# Altium project AMEv3.PrjPCB
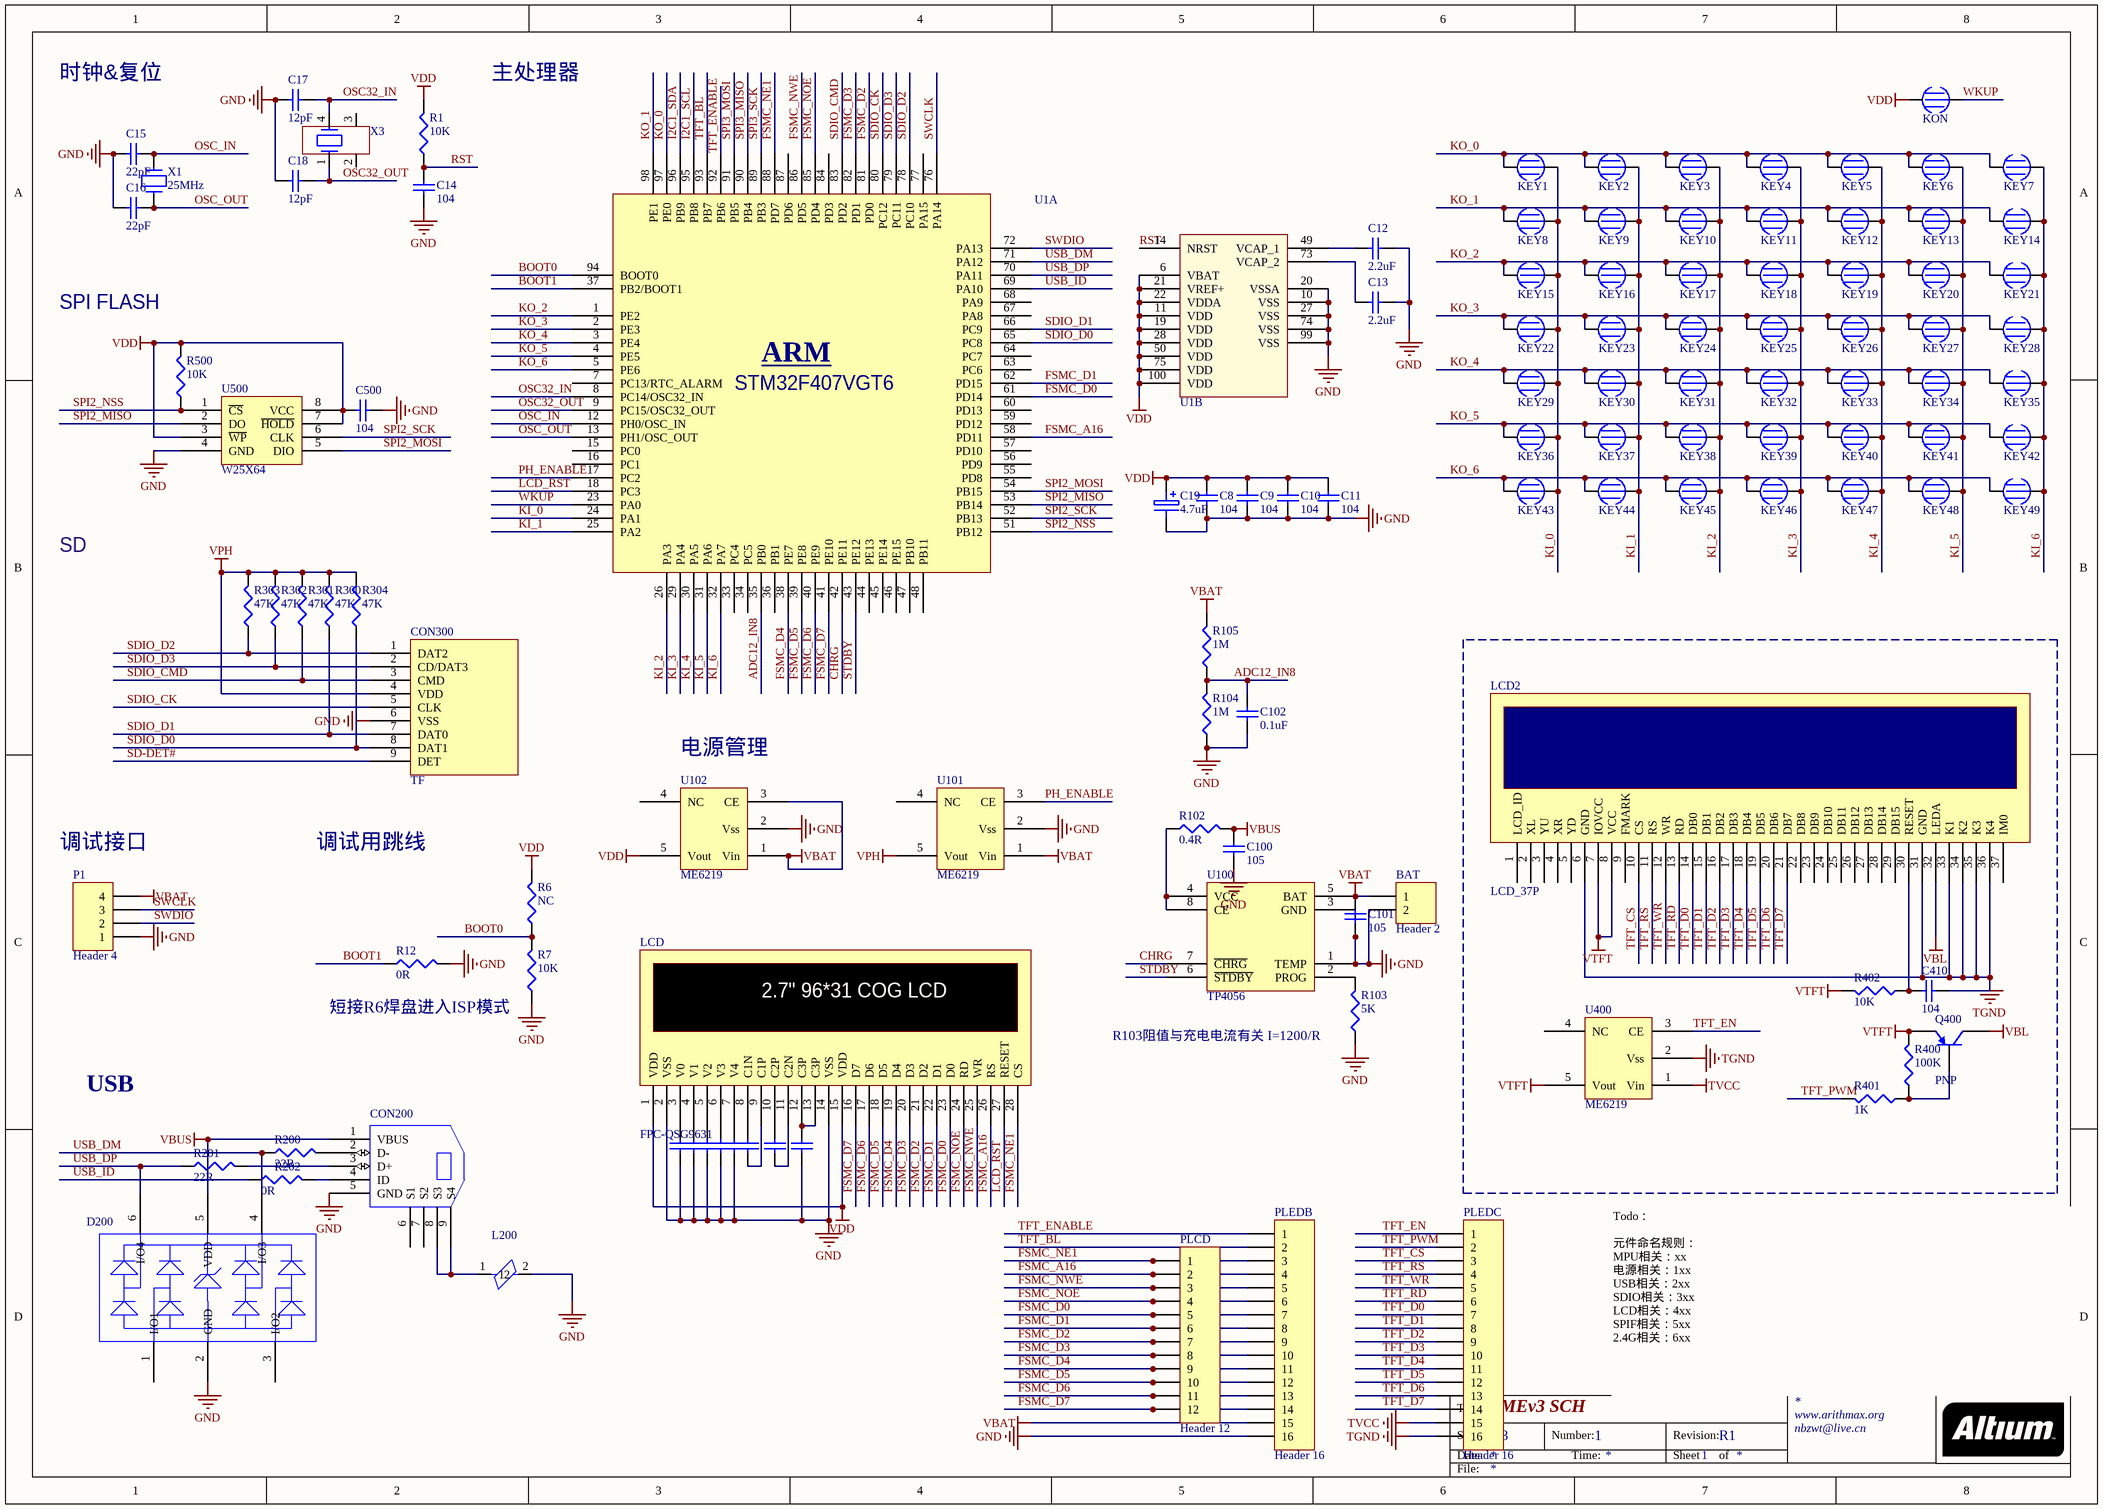
[diagram p0: SheetMain.SchDoc]
1 sheet, 115 parts. Net scope: global (net labels, ports and power ports of the same name join across sheets).
Board file: PCB1-B.PcbDoc

## Sheet SheetMain.SchDoc: AMEv3 SCH
size A3; ApprovedBy: Zweb; CheckedBy: Zweb; Author: Zweb; CompanyName: AMTech; DrawnBy: Zweb; Engineer: Zweb; Address1: www.arithmax.org; Address2: nbzwt@live.cn; DocumentNumber: 1; Revision: R1; SheetNumber: 1; DocumentName: AMEv3 Sch; ProjectName: ArithMax Entry

### Parts
BAT  Header 2  [HDR1X2]
C8  104  [1608[0603]]
C9  104  [1608[0603]]
C10  104  [1608[0603]]
C11  104  [1608[0603]]
C12  2.2uF  [1608[0603]]
C13  2.2uF  [1608[0603]]
C14  104  [1608[0603]]
C15  22pF  [1608[0603]]
C16  22pF  [1608[0603]]
C17  12pF  [1608[0603]]
C18  12pF  [1608[0603]]
C19  4.7uF  [1608[0603]]
C100  105  [1608[0603]]
C101  105  [1608[0603]]
C102  0.1uF  [1608[0603]]
C400  2.2uF  [1608[0603]]  (value not drawn)
C401  2.2uF  [1608[0603]]  (value not drawn)
C402  2.2uF  [1608[0603]]  (value not drawn)
C403  2.2uF  [1608[0603]]  (value not drawn)
C404  2.2uF  [1608[0603]]  (value not drawn)
C405  2.2uF  [1608[0603]]  (value not drawn)
C406  0.1uF  [1608[0603]]  (value not drawn)
C407  0.1uF  [1608[0603]]  (value not drawn)
C410  104  [1608[0603]]
C500  104  [1608[0603]]
CON200  USB-MINIAB  [USB-MICRO]  (value not drawn)
CON300  TF  [TF-2]
D200  AZC099-04S  [SOT-23-6]  (value not drawn)
KEY1  Button  [Button]  (value not drawn)
KEY2  Button  [Button]  (value not drawn)
KEY3  Button  [Button]  (value not drawn)
KEY4  Button  [Button]  (value not drawn)
KEY5  Button  [Button]  (value not drawn)
KEY6  Button  [Button]  (value not drawn)
KEY7  Button  [Button]  (value not drawn)
KEY8  Button  [Button]  (value not drawn)
KEY9  Button  [Button]  (value not drawn)
KEY10  Button  [Button]  (value not drawn)
KEY11  Button  [Button]  (value not drawn)
KEY12  Button  [Button]  (value not drawn)
KEY13  Button  [Button]  (value not drawn)
KEY14  Button  [Button]  (value not drawn)
KEY15  Button  [Button]  (value not drawn)
KEY16  Button  [Button]  (value not drawn)
KEY17  Button  [Button]  (value not drawn)
KEY18  Button  [Button]  (value not drawn)
KEY19  Button  [Button]  (value not drawn)
KEY20  Button  [Button]  (value not drawn)
KEY21  Button  [Button]  (value not drawn)
KEY22  Button  [Button]  (value not drawn)
KEY23  Button  [Button]  (value not drawn)
KEY24  Button  [Button]  (value not drawn)
KEY25  Button  [Button]  (value not drawn)
KEY26  Button  [Button]  (value not drawn)
KEY27  Button  [Button]  (value not drawn)
KEY28  Button  [Button]  (value not drawn)
KEY29  Button  [Button]  (value not drawn)
KEY30  Button  [Button]  (value not drawn)
KEY31  Button  [Button]  (value not drawn)
KEY32  Button  [Button]  (value not drawn)
KEY33  Button  [Button]  (value not drawn)
KEY34  Button  [Button]  (value not drawn)
KEY35  Button  [Button]  (value not drawn)
KEY36  Button  [Button]  (value not drawn)
KEY37  Button  [Button]  (value not drawn)
KEY38  Button  [Button]  (value not drawn)
KEY39  Button  [Button]  (value not drawn)
KEY40  Button  [Button]  (value not drawn)
KEY41  Button  [Button]  (value not drawn)
KEY42  Button  [Button]  (value not drawn)
KEY43  Button  [Button]  (value not drawn)
KEY44  Button  [Button]  (value not drawn)
KEY45  Button  [Button]  (value not drawn)
KEY46  Button  [Button]  (value not drawn)
KEY47  Button  [Button]  (value not drawn)
KEY48  Button  [Button]  (value not drawn)
KEY49  Button  [Button]  (value not drawn)
KON  Button  [Button]  (value not drawn)
L200  BLM21PG221SN1  [0805]  (value not drawn)
LCD  FPC-QSG9631  [LCD_28P]
LCD2  LCD_37P  [LCD_37P]
P1  Header 4  [HDR1X4]
PLCD  Header 12  [HDR1X12]
PLEDB  Header 16  [CON_16P_1.0MM]
PLEDC  Header 16  [CON_16P_1.0MM]
Q400  PNP  [SOT-23B_N]
R1  10K  [J1-0603]
R6  NC  [J1-0603]
R7  10K  [J1-0603]
R12  0R  [J1-0603]
R102  0.4R  [J1-0603]
R103  5K  [J1-0603]
R104  1M  [J1-0603]
R105  1M  [J1-0603]
R200  22R  [J1-0603]
R201  22R  [J1-0603]
R202  0R  [J1-0603]
R300  47K  [J1-0603]
R301  47K  [J1-0603]
R302  47K  [J1-0603]
R303  47K  [J1-0603]
R304  47K  [J1-0603]
R400  100K  [J1-0603]
R401  1K  [J1-0603]
R402  10K  [J1-0603]
R500  10K  [J1-0603]
U1  STM32F407VG  [100T1_L]  (value not drawn)  (parts A,B of 2)
U100  TP4056  [SO-8]
U101  ME6219  [SOT-23-5]
U102  ME6219  [SOT-23-5]
U400  ME6219  [SOT-23-5]
U500  W25X64  [SOIC8]
X1  25MHz  [5032]
X3  MC306-G-06Q-32.768 (manufacturer JFVNY)  [SM8]  (value not drawn)

### Nets
GND: BAT.2 C8.2 C9.2 C10.2 C11.2 C12.2 C13.2 C14.1 C15.2 C16.2 C17.2 C18.2 C19.2(E) C100.1 C101.1 C102.1 C400.1 C401.1 C402.1 C403.1 C404.1 C407.1 C500.2 CON200.5(GND) CON300.6(VSS) D200.2(GND) L200.2 LCD.2(VSS) LCD.14(VSS) P1.1 PLEDB.16 R7.1 R12.2 R103.1 R104.1 U1.10(VSS) U1.20(VSSA) U1.27(VSS) U1.74(VSS) U1.99(VSS) U100.1(TEMP) U100.3(GND) U101.2(Vss) U102.2(Vss) U500.4(GND)
TGND: C410.1 LCD2.6(GND) LCD2.31(GND) LCD2.33(K1) LCD2.34(K2) LCD2.35(K3) LCD2.36(K4) PLEDC.16 U400.2(Vss)
TVCC: PLEDC.15 U400.1(Vin)
VBAT: BAT.1 C101.2 P1.4 PLEDB.15 R105.2 U100.5(BAT) U101.1(Vin) U102.1(Vin) U102.3(CE)
VBL: LCD2.32(LEDA) Q400.1(C)
VBUS: C100.2 CON200.1(VBUS) D200.5(VDD) R102.2
VDD: C8.1 C9.1 C10.1 C11.1 C19.1 C500.1 KON.1 LCD.1(VDD) LCD.15(VDD) R1.2 R6.2 R500.2 U1.6(VBAT) U1.11(VDD) U1.19(VDD) U1.21(VREF+) U1.22(VDDA) U1.28(VDD) U1.50(VDD) U1.75(VDD) U1.100(VDD) U102.5(Vout) U500.3(~{WP}) U500.7(~{HOLD}) U500.8(VCC)
VPH: CON300.4(VDD) R300.2 R301.2 R302.2 R303.2 R304.2 U101.5(Vout)
VTFT: LCD2.7(IOVCC) LCD2.8(VCC) Q400.3(E) R400.2 R402.2 U400.5(Vout)
ADC12_IN8: C102.2 R104.2 R105.1 U1.35(PB0)
BOOT0: R6.1 R7.2 U1.94(BOOT0)
BOOT1: R12.1 U1.37(PB2/BOOT1)
CHRG: U1.42(PE11) U100.7(~{CHRG})
FSMC_A16: LCD.26(RS) PLCD.2 PLEDB.4 U1.58(PD11)
FSMC_D0: LCD.23(D0) PLCD.5 PLEDB.7 U1.61(PD14)
FSMC_D1: LCD.22(D1) PLCD.6 PLEDB.8 U1.62(PD15)
FSMC_D2: LCD.21(D2) PLCD.7 PLEDB.9 U1.81(PD0)
FSMC_D3: LCD.20(D3) PLCD.8 PLEDB.10 U1.82(PD1)
FSMC_D4: LCD.19(D4) PLCD.9 PLEDB.11 U1.38(PE7)
FSMC_D5: LCD.18(D5) PLCD.10 PLEDB.12 U1.39(PE8)
FSMC_D6: LCD.17(D6) PLCD.11 PLEDB.13 U1.40(PE9)
FSMC_D7: LCD.16(D7) PLCD.12 PLEDB.14 U1.41(PE10)
FSMC_NE1: LCD.28(CS) PLCD.1 PLEDB.3 U1.88(PD7)
FSMC_NOE: LCD.24(RD) PLCD.4 PLEDB.6 U1.85(PD4)
FSMC_NWE: LCD.25(WR) PLCD.3 PLEDB.5 U1.86(PD5)
I2C1_SCL: U1.95(PB8)
I2C1_SDA: U1.96(PB9)
KI_0: KEY1.2 KEY8.2 KEY15.2 KEY22.2 KEY29.2 KEY36.2 KEY43.2 U1.24(PA1)
KI_1: KEY2.2 KEY9.2 KEY16.2 KEY23.2 KEY30.2 KEY37.2 KEY44.2 U1.25(PA2)
KI_2: KEY3.2 KEY10.2 KEY17.2 KEY24.2 KEY31.2 KEY38.2 KEY45.2 U1.26(PA3)
KI_3: KEY4.2 KEY11.2 KEY18.2 KEY25.2 KEY32.2 KEY39.2 KEY46.2 U1.29(PA4)
KI_4: KEY5.2 KEY12.2 KEY19.2 KEY26.2 KEY33.2 KEY40.2 KEY47.2 U1.30(PA5)
KI_5: KEY6.2 KEY13.2 KEY20.2 KEY27.2 KEY34.2 KEY41.2 KEY48.2 U1.31(PA6)
KI_6: KEY7.2 KEY14.2 KEY21.2 KEY28.2 KEY35.2 KEY42.2 KEY49.2 U1.32(PA7)
KO_0: KEY1.1 KEY2.1 KEY3.1 KEY4.1 KEY5.1 KEY6.1 KEY7.1 U1.97(PE0)
KO_1: KEY8.1 KEY9.1 KEY10.1 KEY11.1 KEY12.1 KEY13.1 KEY14.1 U1.98(PE1)
KO_2: KEY15.1 KEY16.1 KEY17.1 KEY18.1 KEY19.1 KEY20.1 KEY21.1 U1.1(PE2)
KO_3: KEY22.1 KEY23.1 KEY24.1 KEY25.1 KEY26.1 KEY27.1 KEY28.1 U1.2(PE3)
KO_4: KEY29.1 KEY30.1 KEY31.1 KEY32.1 KEY33.1 KEY34.1 KEY35.1 U1.3(PE4)
KO_5: KEY36.1 KEY37.1 KEY38.1 KEY39.1 KEY40.1 KEY41.1 KEY42.1 U1.4(PE5)
KO_6: KEY43.1 KEY44.1 KEY45.1 KEY46.1 KEY47.1 KEY48.1 KEY49.1 U1.5(PE6)
LCD_RST: LCD.27(RESET) U1.18(PC3)
OSC32_IN: C17.1 U1.8(PC14/OSC32_IN) X3.4
OSC32_OUT: C18.1 U1.9(PC15/OSC32_OUT) X3.1
OSC_IN: C15.1 U1.12(PH0/OSC_IN) X1.2
OSC_OUT: C16.1 U1.13(PH1/OSC_OUT) X1.1
PH_ENABLE: U1.17(PC2) U101.3(CE)
RST: C14.2 R1.1 U1.14(NRST)
SD-DET#: CON300.9(DET)
SDIO_CK: CON300.5(CLK) U1.80(PC12)
SDIO_CMD: CON300.3(CMD) R301.1 U1.83(PD2)
SDIO_D0: CON300.8(DAT1) R304.1 U1.65(PC8)
SDIO_D1: CON300.7(DAT0) R300.1 U1.66(PC9)
SDIO_D2: CON300.1(DAT2) R303.1 U1.78(PC10)
SDIO_D3: CON300.2(CD/DAT3) R302.1 U1.79(PC11)
SPI2_MISO: U1.53(PB14) U500.2(DO)
SPI2_MOSI: U1.54(PB15) U500.5(DIO)
SPI2_NSS: R500.1 U1.51(PB12) U500.1(~{CS})
SPI2_SCK: U1.52(PB13) U500.6(CLK)
SPI3_MISO: U1.90(PB4)
SPI3_MOSI: U1.91(PB5)
SPI3_SCK: U1.89(PB3)
STDBY: U1.43(PE12) U100.6(~{STDBY})
SWCLK: P1.3 U1.76(PA14)
SWDIO: P1.2 U1.72(PA13)
TFT_BL: PLEDB.2 U1.93(PB7)
TFT_CS: LCD2.10(CS) PLEDC.3
TFT_D0: LCD2.14(DB0) PLEDC.7
TFT_D1: LCD2.15(DB1) PLEDC.8
TFT_D2: LCD2.16(DB2) PLEDC.9
TFT_D3: LCD2.17(DB3) PLEDC.10
TFT_D4: LCD2.18(DB4) PLEDC.11
TFT_D5: LCD2.19(DB5) PLEDC.12
TFT_D6: LCD2.20(DB6) PLEDC.13
TFT_D7: LCD2.21(DB7) PLEDC.14
TFT_EN: PLEDC.1 U400.3(CE)
TFT_ENABLE: PLEDB.1 U1.92(PB6)
TFT_PWM: PLEDC.2 R401.2
TFT_RD: LCD2.13(RD) PLEDC.6
TFT_RS: LCD2.11(RS) PLEDC.4
TFT_WR: LCD2.12(WR) PLEDC.5
USB_DM: D200.4(I/O3) R200.1 U1.71(PA12)
USB_DP: D200.6(I/O4) R201.1 U1.70(PA11)
USB_ID: R202.1 U1.69(PA10)
WKUP: KON.2 U1.23(PA0)
NetC12_1: C12.1 U1.49(VCAP_1)
NetC13_1: C13.1 U1.73(VCAP_2)
NetC400_2: C400.2 LCD.3(V0)
NetC401_2: C401.2 LCD.4(V1)
NetC402_2: C402.2 LCD.5(V2)
NetC403_2: C403.2 LCD.6(V3)
NetC404_2: C404.2 LCD.7(V4)
NetC405_1: C405.1 LCD.9(C1P)
NetC405_2: C405.2 LCD.8(C1N)
NetC406_1: C406.1 LCD.11(C2N)
NetC406_2: C406.2 LCD.10(C2P)
NetC407_2: C407.2 LCD.12(C3P) LCD.13(C3P)
NetC410_2: C410.2 LCD2.30(RESET) R402.1
NetCON200_2: CON200.2(D-) R200.2
NetCON200_3: CON200.3(D+) R201.2
NetCON200_4: CON200.4(ID) R202.2
NetCON200_8: CON200.8(S3) CON200.9(S4) L200.1
NetQ400_2: Q400.2(B) R400.1 R401.1
NetR102_1: R102.1 U100.4(VCC) U100.8(CE)
NetR103_2: R103.2 U100.2(PROG)

Not connected (* = marked no-connect by the designer): CON200 6(S1) 7(S2); D200 1(I/O1) 3(I/O2); LCD2 1(LCD_ID) 2(XL) 3(YU) 4(XR) 5(YD) 9(FMARK) 22(DB8) 23(DB9) 24(DB10) 25(DB11) 26(DB12) 27(DB13) 28(DB14) 29(DB15) 37(IM0); U1 7(PC13/RTC_ALARM) 15(PC0) 16(PC1) 33(PC4) 34(PC5) 36(PB1) 44(PE13) 45(PE14) 46(PE15) 47(PB10) 48(PB11) 55(PD8) 56(PD9) 57(PD10) 59(PD12) 60(PD13) 63(PC6) 64(PC7) 67(PA8) 68(PA9) 77(PA15) 84(PD3) 87(PD6); U101 4(NC); U102 4(NC); U400 4(NC); X3 2 3

### Notes on the sheet
- 时钟&复位
- 主处理器
- (near R500) SPI FLASH
- SD
- (near U102) 电源管理
- (near P1) 调试接口
- 调试用跳线
- (near R12) 短接R6焊盘进入ISP模式
- (near U100) R103阻值与充电电流有关 I=1200/R
- USB
- Todo：
  元件命名规则：
  MPU相关：xx
  电源相关：1xx
  USB相关：2xx
  SDIO相关：3xx
  LCD相关：4xx
  SPIF相关：5xx
  2.4G相关：6xx
- Title
- Size:
- Date:
- A3
- Number:
- Time:
- Revision:
- Sheet
- of
- File:
- (in symbol FPC14591A) TY 96*31 COG LCD
- (in symbol STM32F407VG, part A) ARM; STM32F407VGT6

### Library data of the parts
BAT = Header 2: Header, 2-Pin; LatestRevisionDate: 17-Jul-2002; LatestRevisionNote: Re-released for DXP Platform.; Publisher: Altium Limited
C8-C18 C500 = Cap Semi: Capacitor (Semiconductor SIM Model); Published: 8-Jun-2000; LatestRevisionDate: 29-May-2009; LatestRevisionNote: IPC-7351 Footprint Added.; PackageReference: C1206; Publisher: Altium Limited; PackageDescription: Chip Capacitor
  C8-C11 C14 C500: Value: 104
  C12 C13: Value: 2.2uF
  C15 C16: Value: 22pF
  C17 C18: Value: 12pF
C19 = EC
C100-C102 C400-C407 C410 = Cap Semi: Capacitor (Semiconductor SIM Model); Value: 100pF; Published: 8-Jun-2000; LatestRevisionDate: 29-May-2009; LatestRevisionNote: IPC-7351 Footprint Added.; PackageReference: C1206; Publisher: Altium Limited; PackageDescription: Chip Capacitor
CON200 = USB-MINIAB: PCB DECAL: HIROSE-US60B-MB-5ST; Source_Path: Z:\ORCAD\CONNECTOR.OLB; Value: miniAB
D200 = AZC099-04S: PCB DECAL: SOT95P280X100-6; Source_Path: Z:\ORCAD\MYDEVICE.OLB; Value: AZC099-04S
L200 = BEAD__FERRITE: EMI Suppression Filters,2A,0805; Part_Number: 320-22001-1; Part_Type: Inductor; Manufacturer: Murata; Manufacturer_Part_Number: BLM21PG221SN1x; PCB DECAL: R0805; Source_Path: E:\CADENCELIBRARY\SYMBOLS_PASSIVE.OLB; Value: 220ohm at 100MHz; RoHS: Yes
P1 = Header 4: Header, 4-Pin; LatestRevisionDate: 17-Jul-2002; LatestRevisionNote: Re-released for DXP Platform.; Publisher: Altium Limited
PLCD = Header 12: Header, 12-Pin; LatestRevisionDate: 17-Jul-2002; LatestRevisionNote: Re-released for DXP Platform.; Publisher: Altium Limited
PLEDB PLEDC = Header 16: Header, 16-Pin; LatestRevisionDate: 17-Jul-2002; LatestRevisionNote: Re-released for DXP Platform.; Publisher: Altium Limited
Q400 = PNP: PNP Bipolar Transistor; Published: 8-Jun-2000; LatestRevisionDate: 29-May-2009; LatestRevisionNote: IPC-7351 Footprint Added.; PackageVersion: Aug-1999; PackageReference: SOT-23B; Publisher: Altium Limited; PackageDescription: 3-Pin SOT-23 Package 0.95 mm Pitch, 2.4 mm Lead Span
R1 R12 R200-R202 R401 R500 = Res3: Resistor; Published: 8-Jun-2000; LatestRevisionDate: 29-May-2009; LatestRevisionNote: IPC-7351 Footprint Added.; PackageReference: J1-0603; Publisher: Altium Limited; PackageDescription: Chip Resistor
  R1 R500: Value: 10K
  R12 R202: Value: 0R
  R200 R201: Value: 22R
  R401: Value: 1K
R6 R7 R102-R105 R300-R304 R400 R402 = Res3: Resistor; Value: 1K; Published: 8-Jun-2000; LatestRevisionDate: 29-May-2009; LatestRevisionNote: IPC-7351 Footprint Added.; PackageReference: J1-0603; Publisher: Altium Limited; PackageDescription: Chip Resistor
U1 = STM32F407VG: ARM Cortex-M3 Microcontroller
U500 = W25X16
X1 = CRYSTAL
X3 = MC306